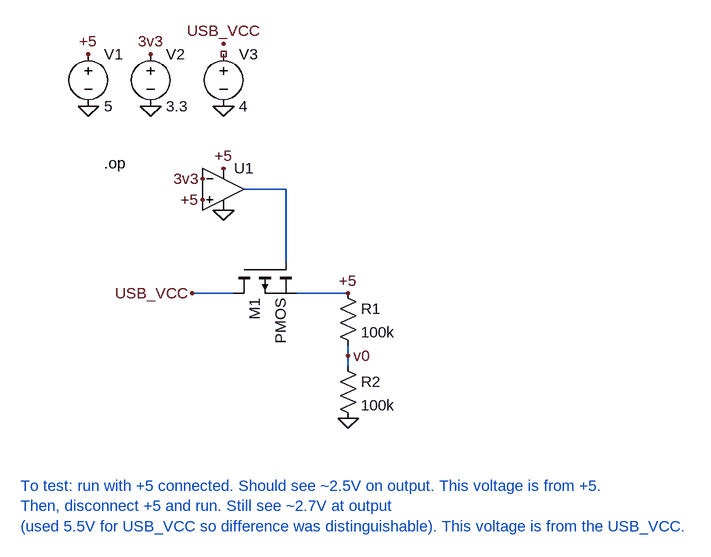
[diagram p0: schematic power_selection_test.asc]
power_selection_test.asc, the LTspice schematic file:
Version 4.1
SHEET 1 1516 680
WIRE 192 32 128 32
WIRE 192 144 192 32
WIRE 112 192 48 192
WIRE 288 192 208 192
WIRE 288 288 288 272
WIRE 288 304 288 288
FLAG -112 -96 0
FLAG 96 64 0
FLAG -112 -176 +5
FLAG 96 0 +5
FLAG 64 48 +5
FLAG 64 16 3v3
FLAG -16 -96 0
FLAG -16 -176 3v3
FLAG 96 -96 0
FLAG 96 -192 USB_VCC
FLAG 48 192 USB_VCC
FLAG 288 192 +5
FLAG 288 384 0
FLAG 288 288 v0
SYMBOL pmos 112 144 M90
SYMATTR InstName M1
SYMBOL OpAmps\\UniversalOpAmp2 96 32 R0
SYMATTR InstName U1
SYMBOL voltage -112 -192 R0
SYMATTR InstName V1
SYMATTR Value 5
SYMBOL voltage -16 -192 R0
SYMATTR InstName V2
SYMATTR Value 3.3
SYMBOL voltage 96 -192 R0
WINDOW 123 0 0 Left 0
WINDOW 39 0 0 Left 0
SYMATTR InstName V3
SYMATTR Value 4
SYMBOL res 272 176 R0
SYMATTR InstName R1
SYMATTR Value 100k
SYMBOL res 272 288 R0
SYMATTR InstName R2
SYMATTR Value 100k
TEXT -88 -8 Left 2 !.op
TEXT -216 488 Left 2 ;To test: run with +5 connected. Should see ~2.5V on output. This voltage is from +5.\nThen, disconnect +5 and run. Still see ~2.7V at output \n(used 5.5V for USB_VCC so difference was distinguishable). This voltage is from the USB_VCC.

The netlist it stands for:
* power_selection_test.asc
M1 USB_VCC N001 +5 +5 PMOS
X§U1 +5 3v3 +5 0 N001 level2 Avol=1Meg GBW=10Meg Slew=10Meg Ilimit=25m Rail=0 Vos=0 En=0 Enk=0 In=0 Ink=0 Rin=500Meg  ; pins In+ In- V+ V- OUT
V1 +5 0 5
V2 3v3 0 3.3
V3 NC_01 0 4
R1 +5 v0 100k
R2 v0 0 100k
.model NMOS NMOS
.model PMOS PMOS
.lib standard.mos
.op
* To test: run with +5 connected. Should see ~2.5V on output. This voltage is from +5.
* Then, disconnect +5 and run. Still see ~2.7V at output
* (used 5.5V for USB_VCC so difference was distinguishable). This voltage is from the USB_VCC.
.lib UniversalOpAmp2.lib
.backanno
.end